# Altium schematic sheet Connector_Receptacle.SchDoc
size A4
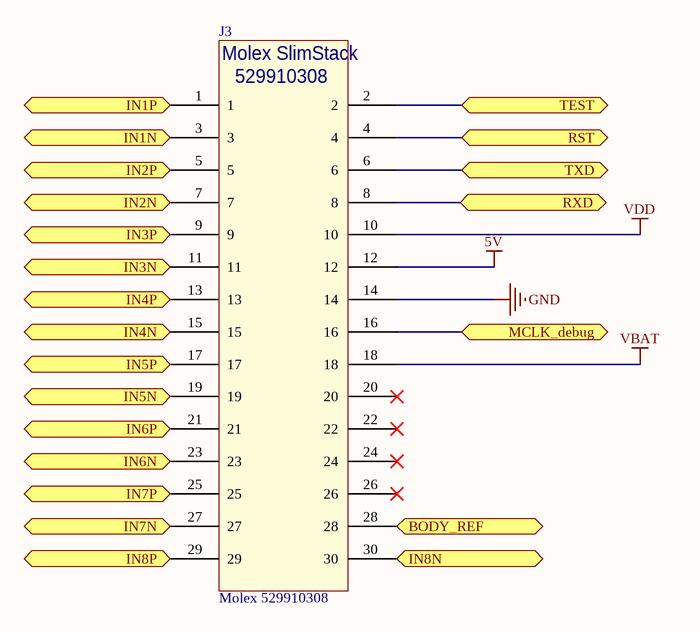
[diagram p0: Connector_Receptacle.SchDoc]

## Parts
J3  Molex 529910308  [Molex 0529910308]

## Ports
BODY_REF (bidir), IN1N (bidir), IN1P (bidir), IN2N (bidir), IN2P (bidir), IN3N (bidir), IN3P (bidir), IN4N (bidir), IN4P (bidir), IN5N (bidir), IN5P (bidir), IN6N (bidir), IN6P (bidir), IN7N (bidir), IN7P (bidir), IN8N (bidir), IN8P (bidir), MCLK_debug (bidir), RST (bidir), RXD (bidir), TEST (bidir), TXD (bidir)

## Nets
5V: J3.12
GND: J3.14
VBAT: J3.18
VDD: J3.10
BODY_REF: J3.28 ; port BODY_REF
IN1N: J3.3 ; port IN1N
IN1P: J3.1 ; port IN1P
IN2N: J3.7 ; port IN2N
IN2P: J3.5 ; port IN2P
IN3N: J3.11 ; port IN3N
IN3P: J3.9 ; port IN3P
IN4N: J3.15 ; port IN4N
IN4P: J3.13 ; port IN4P
IN5N: J3.19 ; port IN5N
IN5P: J3.17 ; port IN5P
IN6N: J3.23 ; port IN6N
IN6P: J3.21 ; port IN6P
IN7N: J3.27 ; port IN7N
IN7P: J3.25 ; port IN7P
IN8N: J3.30 ; port IN8N
IN8P: J3.29 ; port IN8P
MCLK_debug: J3.16 ; port MCLK_debug
RST: J3.4 ; port RST
RXD: J3.8 ; port RXD
TEST: J3.2 ; port TEST
TXD: J3.6 ; port TXD

Not connected (* = marked no-connect by the designer): J3 20* 22* 24* 26*

## Notes on the sheet
- (in symbol Molex 529910308) Molex SlimStack; 529910308